# EAGLE schematic Cing_MainBoard (EAGLE 9.4.0)

## Sheet 1 of 7: Cing procesor socket schematic
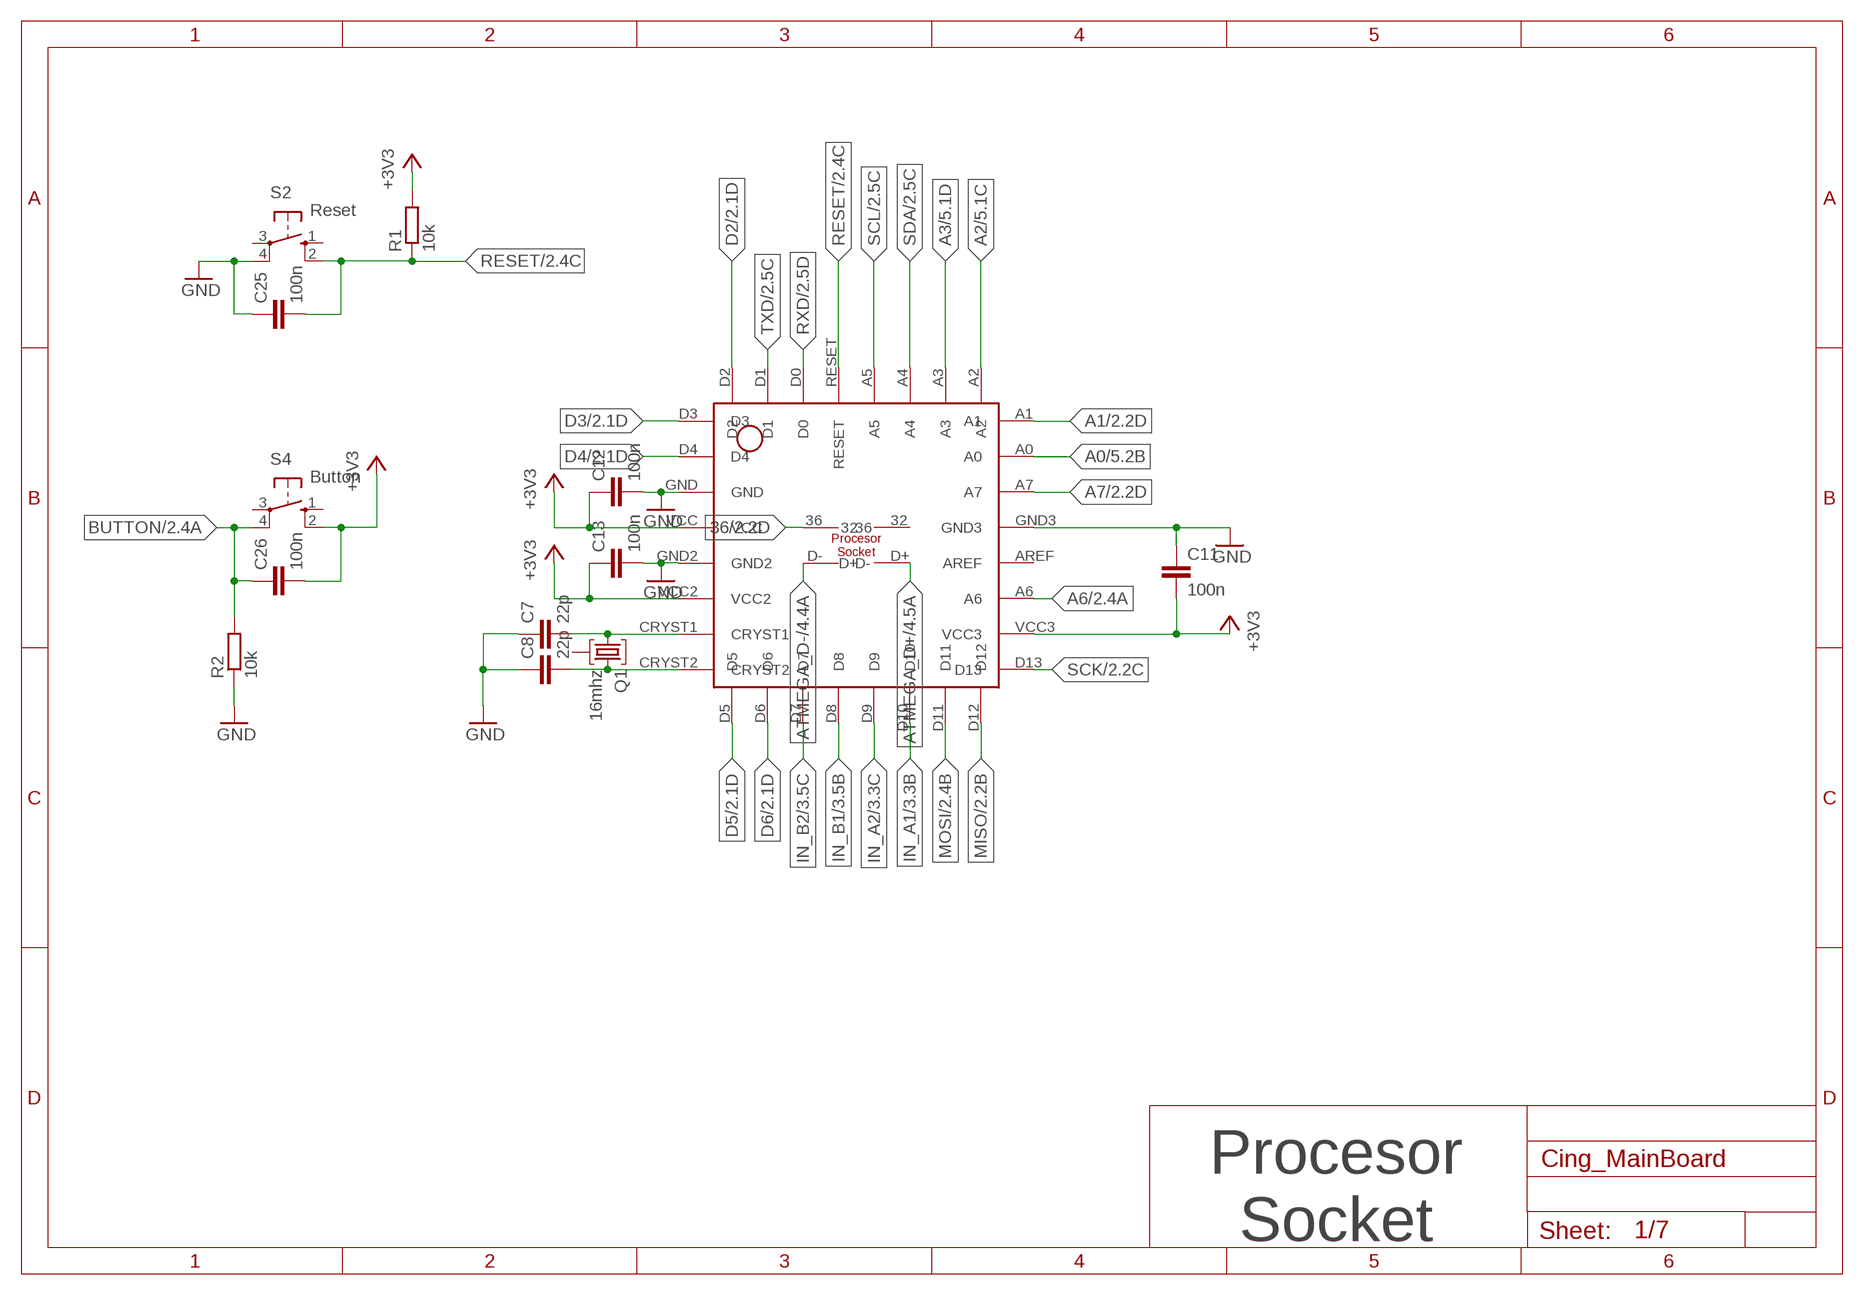
[diagram p0: schematic, sheet 1]

### Parts
C7  22p  C-EUC1206  [C1206]
C8  22p  C-EUC1206  [C1206]
C11  100n  C-EUC1206  [C1206]
C12  100n  C-EUC1206  [C1206]
C13  100n  C-EUC1206  [C1206]
C25  100n  C-EUC1206  [C1206]
C26  100n  C-EUC1206  [C1206]
Q1  16mhz  12M10AHC49HT  [HC49U]
R1  10k  R-EU_R1206  [R1206]
R2  10k  R-EU_R1206  [R1206]
S2  Reset  10-XX  [B3F-10XX]
S4  Button  10-XX  [B3F-10XX]
U$1  PROCESSOR-SOCKET_PCB  [PROCESSOR-SOCKET_PCB]

### Nets
36: U$1.36 ; also sheet 2
+3V3: C11.2 C12.1 C13.1 C26.2 R1.2 S4.2(S1) U$1.VCC U$1.VCC2 U$1.VCC3 ; also sheet 2,3,4,5,6
A0: U$1.A0 ; also sheet 5
A1: U$1.A1 ; also sheet 2,5
A2: U$1.A2 ; also sheet 5
A3: U$1.A3 ; also sheet 5
A6: U$1.A6 ; also sheet 2
A7: U$1.A7 ; also sheet 2,5
ATMEGA_D+: U$1.D+ ; also sheet 4
ATMEGA_D-: U$1.D- ; also sheet 4
BUTTON: C26.1 R2.2 S4.4(P1) ; also sheet 2
D2: U$1.D2 ; also sheet 2,6
D3: U$1.D3 ; also sheet 2
D4: U$1.D4 ; also sheet 2,5
D5: U$1.D5 ; also sheet 2,6
D6: U$1.D6 ; also sheet 2,3
GND: C7.1 C8.1 C11.1 C12.2 C13.2 C25.1 R2.1 S2.4(P1) U$1.GND U$1.GND2 U$1.GND3 ; also sheet 2,3,4,5,6
IN_A1: U$1.D10 ; also sheet 3
IN_A2: U$1.D9 ; also sheet 3
IN_B1: U$1.D8 ; also sheet 3
IN_B2: U$1.D7 ; also sheet 3
MISO: U$1.D12 ; also sheet 2,3
MOSI: U$1.D11 ; also sheet 2,3
N$7: C8.2 Q1.3 U$1.CRYST2
N$14: C7.2 Q1.1 U$1.CRYST1
RESET: C25.2 R1.1 S2.2(S1) U$1.RESET ; also sheet 2,5
RXD: U$1.D0 ; also sheet 2,5
SCK: U$1.D13 ; also sheet 2,5,6
SCL: U$1.A5 ; also sheet 2,4,5,6
SDA: U$1.A4 ; also sheet 2,4,5,6
TXD: U$1.D1 ; also sheet 2,5
Unconnected: Q1.2 S2.1(S) S2.3(P) S4.1(S) S4.3(P) U$1.32 U$1.AREF

### Notes on the sheet
- Procesor
  Socket

## Sheet 2 of 7: Connectors
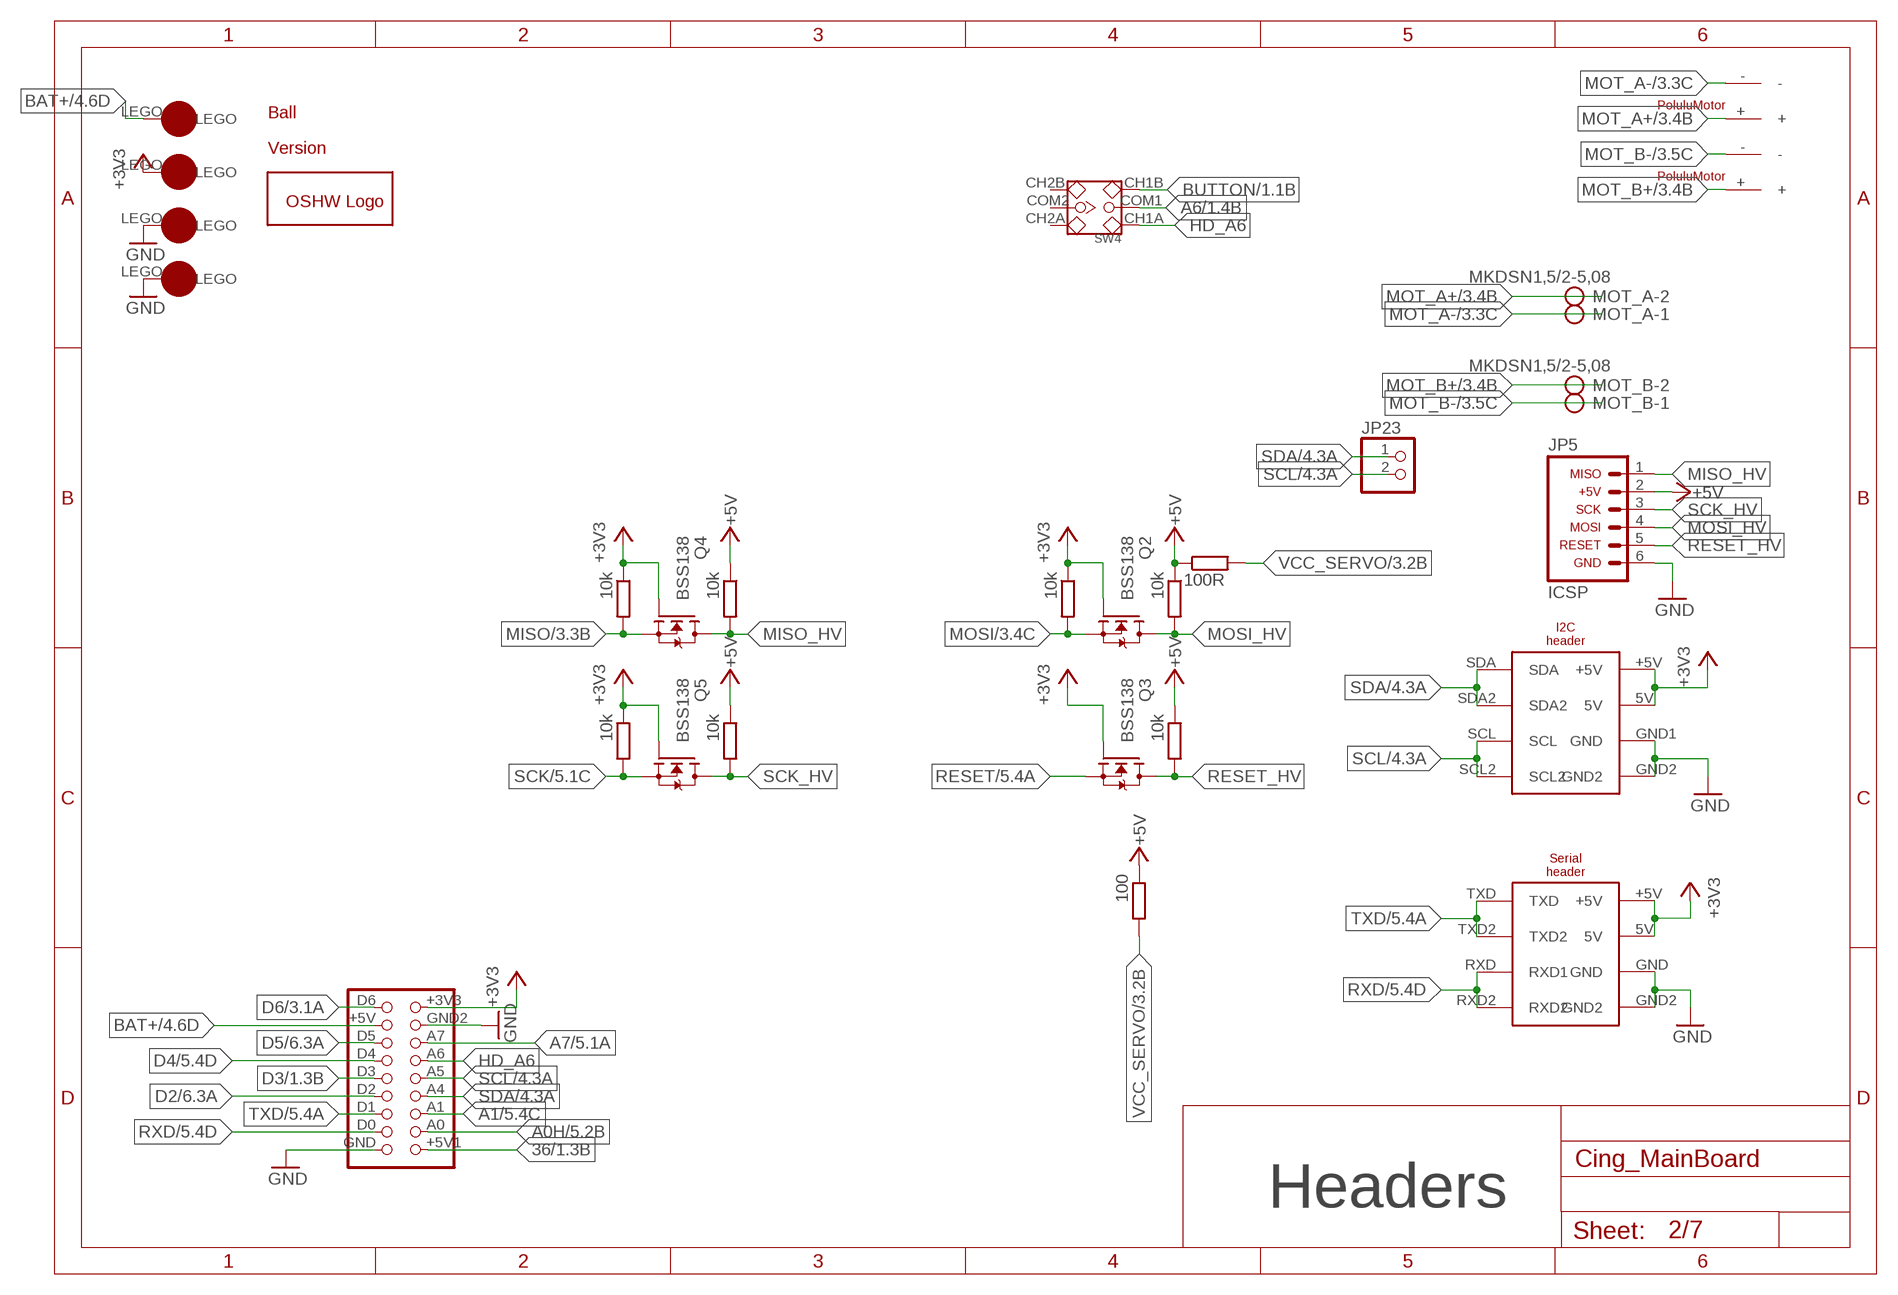
[diagram p1: schematic, sheet 2]

### Parts
JP5  ICSP  ICSP_HEADER  [ICSP_HEADER]
JP23  PINHD-1X2  [1X02]
MOT_A  MKDSN1,5/2-5,08  [MKDSN1,5/2-5,08]
MOT_B  MKDSN1,5/2-5,08  [MKDSN1,5/2-5,08]
Q2  BSS138  [SOT23]
Q3  BSS138  [SOT23]
Q4  BSS138  [SOT23]
Q5  BSS138  [SOT23]
R33  10k  R-EU_R1206  [R1206]
R34  10k  R-EU_R1206  [R1206]
R35  10k  R-EU_R1206  [R1206]
R36  100  R-EU_R1206  [R1206]
R37  10k  R-EU_R1206  [R1206]
R38  10k  R-EU_R1206  [R1206]
R39  10k  R-EU_R1206  [R1206]
R40  10k  R-EU_R1206  [R1206]
R44  100R  R-EU_R1206  [R1206]
SW4  USB_SWITCH  [USB_SWITCH]
U$2  Header 2  BIG_HEADER  [BIG_HEADER]
U$3  I2C_HEADER  [I2_HEADER]
U$4  SERIAL_HEADER  [SERIAL_HEADER]
U$9  POLULU_MOTOR  [POLULU_MOTOR]
U$16  BAT+  LEGO-1X1  [LEGO-1X1]
U$17  3.3V  LEGO-1X1  [LEGO-1X1]
U$18  GND  LEGO-1X1  [LEGO-1X1]
U$19  GND  LEGO-1X1  [LEGO-1X1]
U$20  BALL  [BALL]
U$22  OPENSOURCE  [OSHW_5MM]
U$24  POLULU_MOTOR  [POLULU_MOTOR]
VERSION  4.1  VERSION  [VERSION]

### Nets
36: U$2.+5V1 ; also sheet 1
+3V3: Q2.1(G) Q3.1(G) Q4.1(G) Q5.1(G) R34.1 R38.1 R40.1 U$2.+3V3 U$3.5V U$3.+5V U$4.5V U$4.+5V U$17.LEGO ; also sheet 1,3,4,5,6
+5V: JP5.2 R33.1 R35.1 R36.1 R37.1 R39.1 R44.1
A0H: U$2.A0 ; also sheet 5
A1: U$2.A1 ; also sheet 1,5
A6: SW4.COM1 ; also sheet 1
A7: U$2.A7 ; also sheet 1,5
BAT+: U$2.+5V U$16.LEGO ; also sheet 4
BUTTON: SW4.CH1B ; also sheet 1
D2: U$2.D2 ; also sheet 1,6
D3: U$2.D3 ; also sheet 1
D4: U$2.D4 ; also sheet 1,5
D5: U$2.D5 ; also sheet 1,6
D6: U$2.D6 ; also sheet 1,3
GND: JP5.6 U$2.GND U$2.GND2(GND1) U$3.GND1(GND) U$3.GND2 U$4.GND U$4.GND2 U$18.LEGO U$19.LEGO ; also sheet 1,3,4,5,6
HD_A6: SW4.CH1A U$2.A6
MISO: Q4.2(S) R38.2 ; also sheet 1,3
MISO_HV: JP5.1 Q4.3(D) R37.2
MOSI: Q2.2(S) R34.2 ; also sheet 1,3
MOSI_HV: JP5.4 Q2.3(D) R33.2
MOT_A+: MOT_A.2 U$24.+ ; also sheet 3
MOT_A-: MOT_A.1 U$24.- ; also sheet 3
MOT_B+: MOT_B.2 U$9.+ ; also sheet 3
MOT_B-: MOT_B.1 U$9.- ; also sheet 3
RESET: Q3.2(S) ; also sheet 1,5
RESET_HV: JP5.5 Q3.3(D) R35.2
RXD: U$2.D0 U$4.RXD2 U$4.RXD(RXD1) ; also sheet 1,5
SCK: Q5.2(S) R40.2 ; also sheet 1,5,6
SCK_HV: JP5.3 Q5.3(D) R39.2
SCL: JP23.2 U$2.A5 U$3.SCL U$3.SCL2 ; also sheet 1,4,5,6
SDA: JP23.1 U$2.A4 U$3.SDA U$3.SDA2 ; also sheet 1,4,5,6
TXD: U$2.D1 U$4.TXD U$4.TXD2 ; also sheet 1,5
VCC_SERVO: R36.2 R44.2 ; also sheet 3,4,6
Unconnected: SW4.CH2A SW4.CH2B SW4.COM2

### Notes on the sheet
- Headers

## Sheet 3 of 7: Motor driver schematic
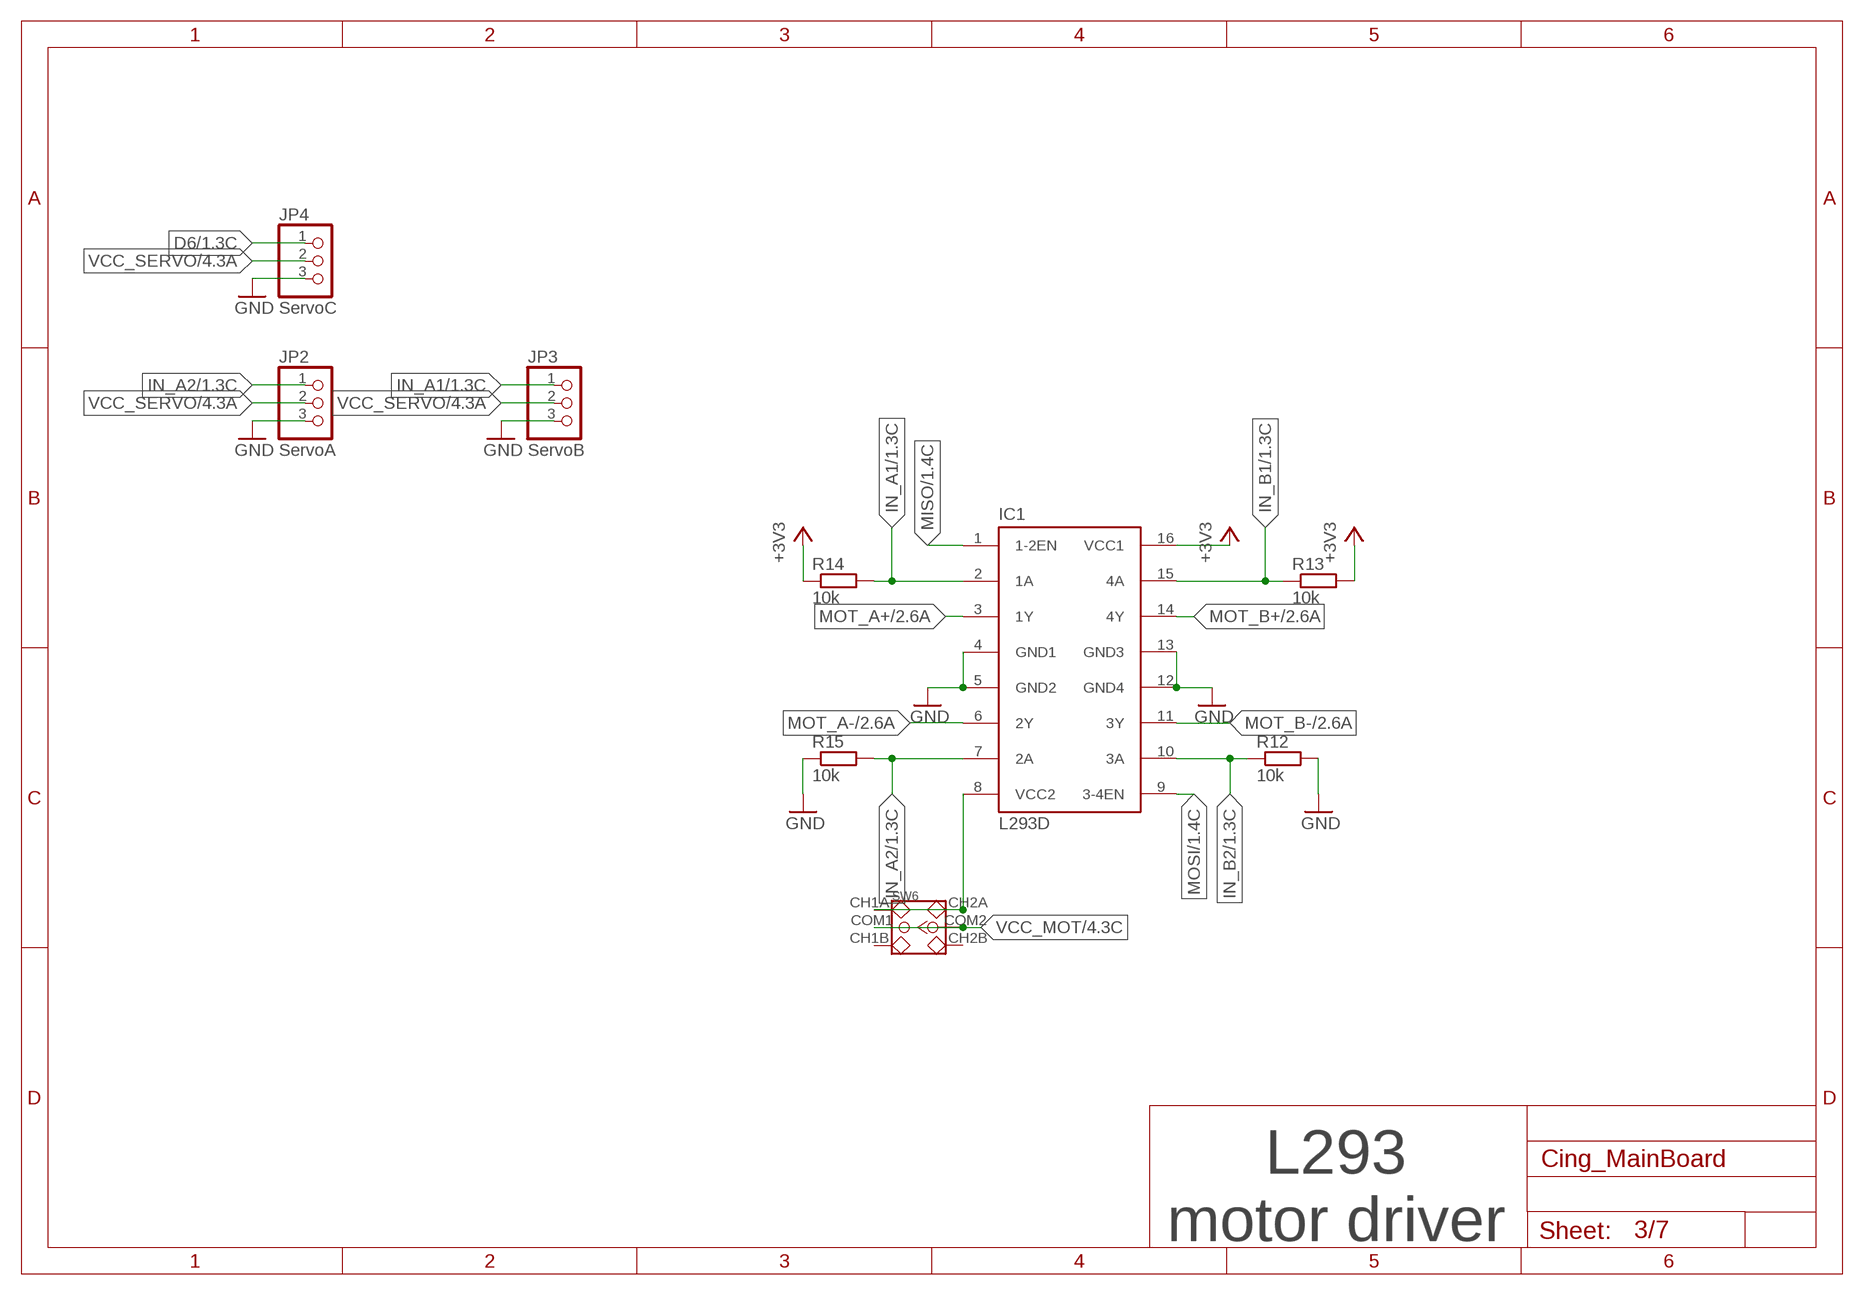
[diagram p2: schematic, sheet 3]

### Parts
IC1  L293D  L293D  [L293]
JP2  ServoA  PINHD-1X3  [1X03]
JP3  ServoB  PINHD-1X3  [1X03]
JP4  ServoC  PINHD-1X3  [1X03]
R12  10k  R-EU_R1206  [R1206]
R13  10k  R-EU_R1206  [R1206]
R14  10k  R-EU_R1206  [R1206]
R15  10k  R-EU_R1206  [R1206]
SW6  USB_SWITCH  [USB_SWITCH]

### Nets
+3V3: IC1.16(VCC1) R13.2 R14.1 ; also sheet 1,2,4,5,6
D6: JP4.1 ; also sheet 1,2
GND: IC1.4(GND1) IC1.5(GND2) IC1.12(GND4) IC1.13(GND3) JP2.3 JP3.3 JP4.3 R12.2 R15.1 ; also sheet 1,2,4,5,6
IN_A1: IC1.2(1A) JP3.1 R14.2 ; also sheet 1
IN_A2: IC1.7(2A) JP2.1 R15.2 ; also sheet 1
IN_B1: IC1.15(4A) R13.1 ; also sheet 1
IN_B2: IC1.10(3A) R12.1 ; also sheet 1
MISO: IC1.1(1-2EN) ; also sheet 1,2
MOSI: IC1.9(3-4EN) ; also sheet 1,2
MOT_A+: IC1.3(1Y) ; also sheet 2
MOT_A-: IC1.6(2Y) ; also sheet 2
MOT_B+: IC1.14(4Y) ; also sheet 2
MOT_B-: IC1.11(3Y) ; also sheet 2
N$4: IC1.8(VCC2) SW6.CH1A SW6.CH2A
VCC_MOT: SW6.COM1 SW6.COM2 ; also sheet 4
VCC_SERVO: JP2.2 JP3.2 JP4.2 ; also sheet 2,4,6
Unconnected: SW6.CH1B SW6.CH2B

### Notes on the sheet
- L293
  motor driver

## Sheet 4 of 7: Power circuits
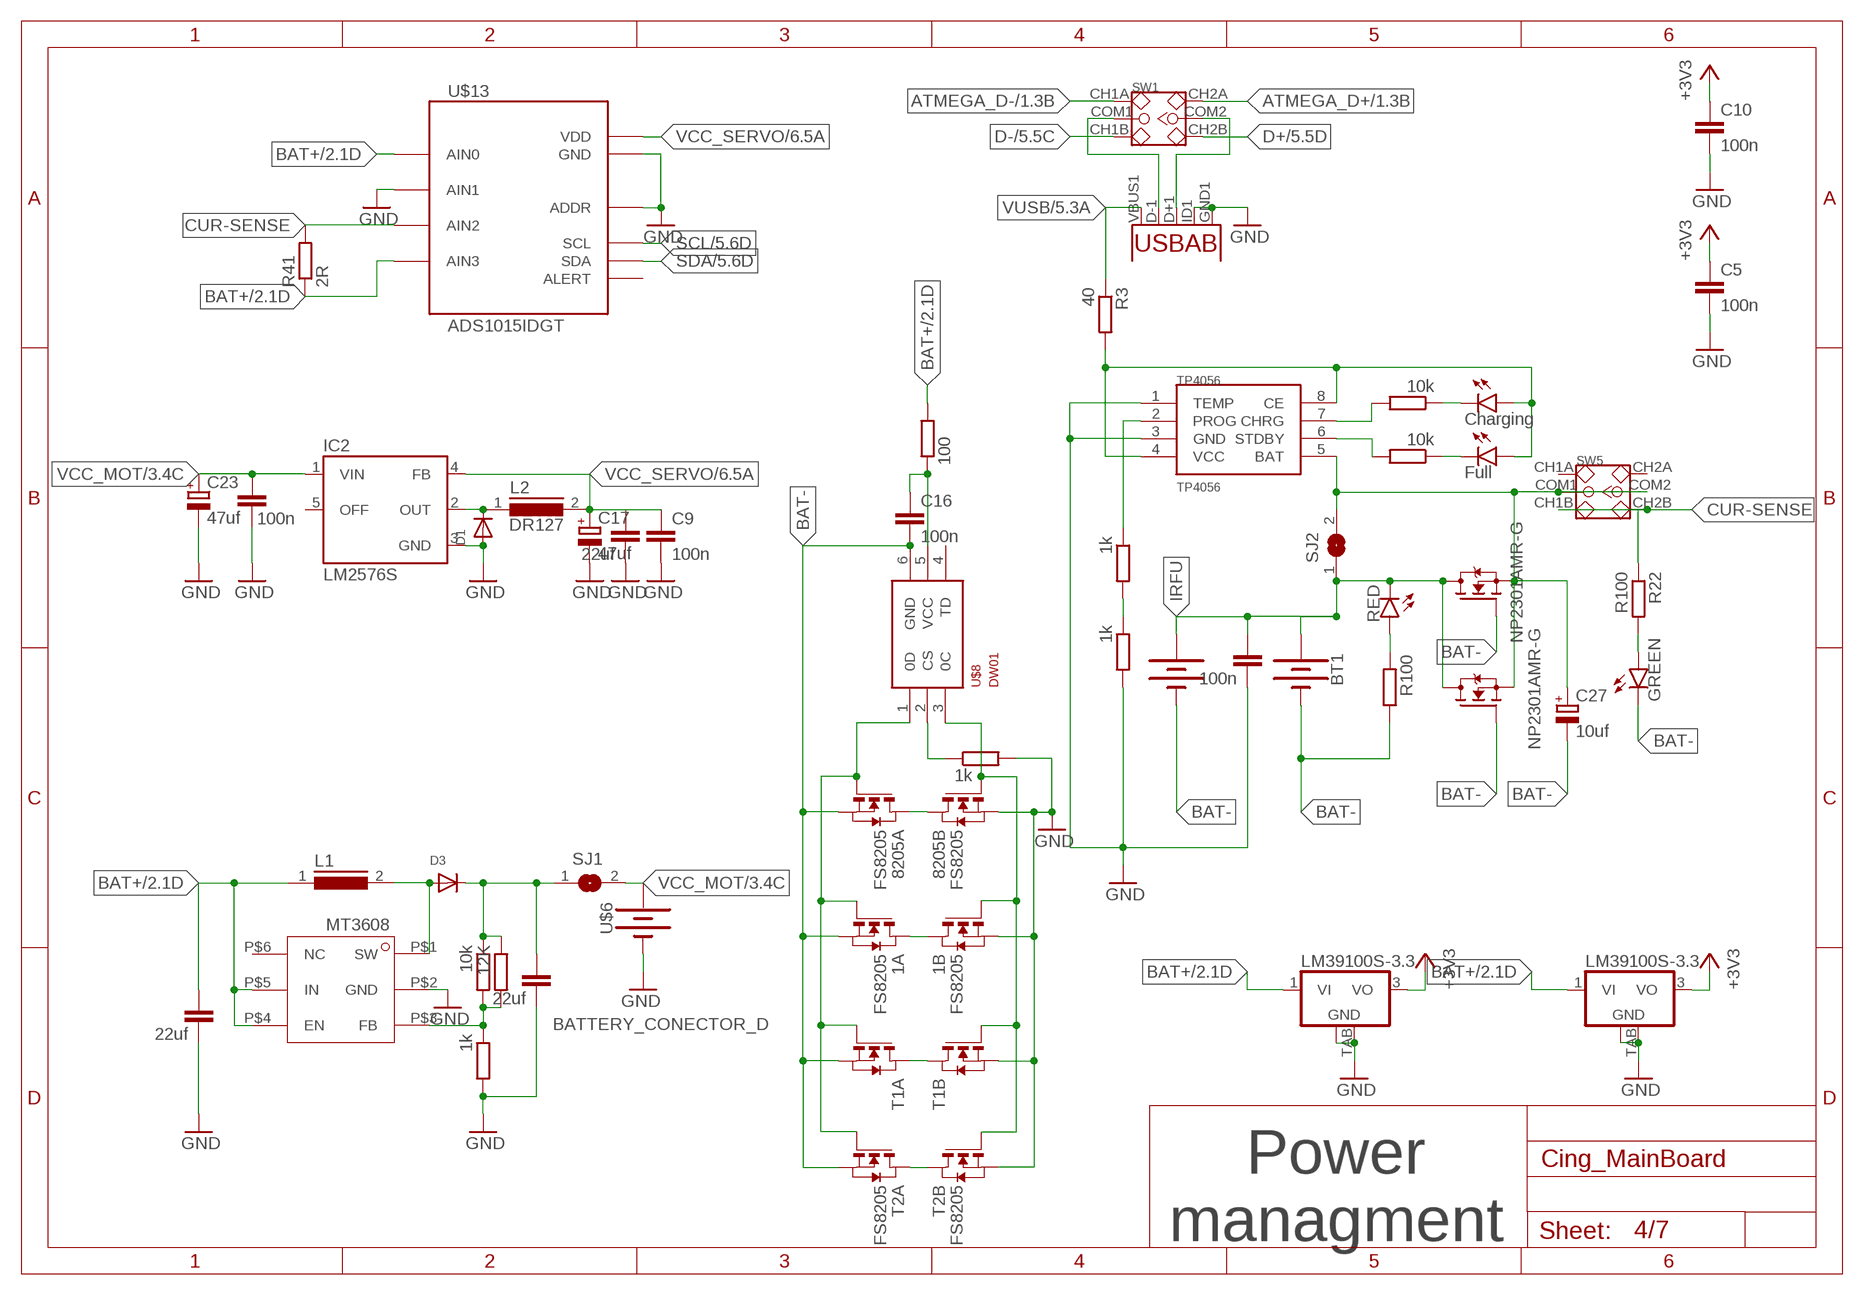
[diagram p3: schematic, sheet 4]

### Parts
1  FS8205  DMN3024LSD  [TSSOP-8]
8205  FS8205  DMN3024LSD  [TSSOP-8]
BT1  BATTERY-AA_KIT  [BATTERY-AA-KIT]
C1  100n  C-EUC1206  [C1206]
C4  22uf  C-EUC1206  [C1206]
C5  100n  C-EUC1206  [C1206]
C9  100n  C-EUC1206  [C1206]
C10  100n  C-EUC1206  [C1206]
C14  22uf  C-EUC1206  [C1206]
C15  22uf  C-EUC1206  [C1206]
C16  100n  C-EUC1206  [C1206]
C17  47uf  CPOL-EU153CLV-0505  [153CLV-0505]
C23  47uf  CPOL-EU153CLV-0505  [153CLV-0505]
C24  100n  C-EUC1206  [C1206]
C27  10uf  CPOL-EU153CLV-0505  [153CLV-0505]
D1  DIODESMA  [SMADIODE]
D3  DIODESMA  [SMADIODE]
IC2  LM2576S  [TO263-5]
L1  DR125  [DR125]
L2  DR127  [DR127]
LED1  Charging  LEDSMT1206  [1206]
ON  GREEN  LEDSMT1206  [1206]
Q6  NP2301AMR-G  [SOT23]
Q7  NP2301AMR-G  [SOT23]
R3  40  R-EU_R1206  [R1206]
R4  1k  R-EU_R1206  [R1206]
R5  10k  R-EU_R1206  [R1206]
R6  R100  R-EU_R1206  [R1206]
R8  1k  R-EU_R1206  [R1206]
R9  10k  R-EU_R1206  [R1206]
R11  10k  R-EU_R1206  [R1206]
R22  R100  R-EU_R1206  [R1206]
R41  2R  R-EU_R1206  [R1206]
R46  1k  R-EU_R1206  [R1206]
R47  1k  R-EU_R1206  [R1206]
R48  100  R-EU_R1206  [R1206]
R49  12K  R-EU_R1206  [R1206]
REV  RED  LEDSMT1206  [1206]
SJ1  SJW  [SJW]
SJ2  SJ  [SJ]
SW1  USB_SWITCH  [USB_SWITCH]
SW5  USB_SWITCH  [USB_SWITCH]
T1  FS8205  DMN3024LSD  [TSSOP-8]
T2  FS8205  DMN3024LSD  [TSSOP-8]
TP4056  TP4056  [TP4056]
U1  MICRO_USB""  [USB-MICRO-SMD]
U$5  MT3608SOT23-6  [SOT23-6]
U$6  BATTERY_CONECTOR_D  [BATTERY_CONECTOR_D]
U$7  BATTERY_CONECTOR_D  [BATTERY_CONECTOR_D]
U$8  DW01  [SOT23-6]
U$13  ADS1015IDGT  [MSOP10_0.5]
U$25  LM39100S-3.3  [LM39100S-3.3]
U$26  LM39100S-3.3  [LM39100S-3.3]
YELLOW  Full  LEDSMT1206  [1206]

### Nets
+3V3: C5.1 C10.1 U$25.3(VO) U$26.3(VO) ; also sheet 1,2,3,5,6
ATMEGA_D+: SW1.CH2A ; also sheet 1
ATMEGA_D-: SW1.CH1A ; also sheet 1
BAT+: C15.1 L1.1 R41.1 R48.2 U$5.P$4(EN) U$5.P$5(IN) U$13.4(AIN0) U$13.7(AIN3) U$25.1(VI) U$26.1(VI) ; also sheet 2
BAT-: 1.2(A:S) 1.3(A:S) 8205.2(A:S) 8205.3(A:S) BT1.GND@1(-) C16.2 C27.- ON.C Q6.1(G) Q7.1(G) R6.1 T1.2(A:S) T1.3(A:S) T2.2(A:S) T2.3(A:S) U$7.- U$8.6(GND)
CUR-SENSE: R22.1 R41.2 SW5.CH1B SW5.CH2B U$13.6(AIN2)
D+: SW1.CH2B ; also sheet 5
D-: SW1.CH1B ; also sheet 5
GND: 1.6(B:S) 1.7(B:S) 8205.6(B:S) 8205.7(B:S) C1.2 C4.2 C5.2 C9.2 C10.2 C14.2 C15.2 C17.- C23.- C24.2 D1.A IC2.3(GND) R8.2 R46.2 R47.2 T1.6(B:S) T1.7(B:S) T2.6(B:S) T2.7(B:S) TP4056.1(TEMP) TP4056.3(GND) U1.GND1(GND) U1.ID1(USBID) U$5.P$2(GND) U$6.- U$13.1(ADDR) U$13.3(GND) U$13.5(AIN1) U$25.2(GND) U$25.TAB(GND_2) U$26.2(GND) U$26.TAB(GND_2) ; also sheet 1,2,3,5,6
IRFU: BT1.PWR@1(+) C1.1 Q6.3(D) Q7.3(D) REV.C SJ2.1 U$7.+
N$3: 1.1(A:D) 1.8(B:D)
N$5: R6.2 REV.A
N$6: R4.2 R8.1
N$8: SW1.COM1 U1.D-1(D-)
N$9: LED1.C R5.1
N$13: SW1.COM2 U1.D+1(D+)
N$16: R11.1 YELLOW.C
N$18: R11.2 TP4056.6(STDBY)
N$19: R5.2 TP4056.7(CHRG)
N$21: D1.C IC2.2(OUT) L2.1
N$25: LED1.A R3.2 TP4056.4(VCC) TP4056.8(CE) YELLOW.A
N$26: C27.+ Q6.2(S) Q7.2(S) SJ2.2 SW5.COM1 SW5.COM2 TP4056.5(BAT)
N$27: R4.1 TP4056.2(PROG)
N$29: ON.A R22.2
N$35: R9.2 R46.1 R49.2 U$5.P$3(FB)
N$44: D3.A L1.2 U$5.P$1(SW)
N$46: C14.1 D3.C R9.1 R49.1 SJ1.1
N$47: 8205.1(A:D) 8205.8(B:D)
N$48: 1.4(A:G) 8205.4(A:G) T1.4(A:G) T2.4(A:G) U$8.1(0D)
N$49: 1.5(B:G) 8205.5(B:G) T1.5(B:G) T2.5(B:G) U$8.3(0C)
N$50: C16.1 R48.1 U$8.5(VCC)
N$54: R47.1 U$8.2(CS)
N$67: T1.1(A:D) T1.8(B:D)
N$68: T2.1(A:D) T2.8(B:D)
SCL: U$13.10(SCL) ; also sheet 1,2,5,6
SDA: U$13.9(SDA) ; also sheet 1,2,5,6
VCC_MOT: C23.+ C24.1 IC2.1(VIN) SJ1.2 U$6.+ ; also sheet 3
VCC_SERVO: C4.1 C9.1 C17.+ IC2.4(FB) L2.2 U$13.8(VDD) ; also sheet 2,3,6
VUSB: R3.1 U1.VBUS1(VBUS) ; also sheet 5
Unconnected: IC2.5(OFF) SW5.CH1A SW5.CH2A U$5.P$6(NC) U$8.4(TD) U$13.2(ALERT)

### Notes on the sheet
- Power
  managment

## Sheet 5 of 7: Board sensors and outputs
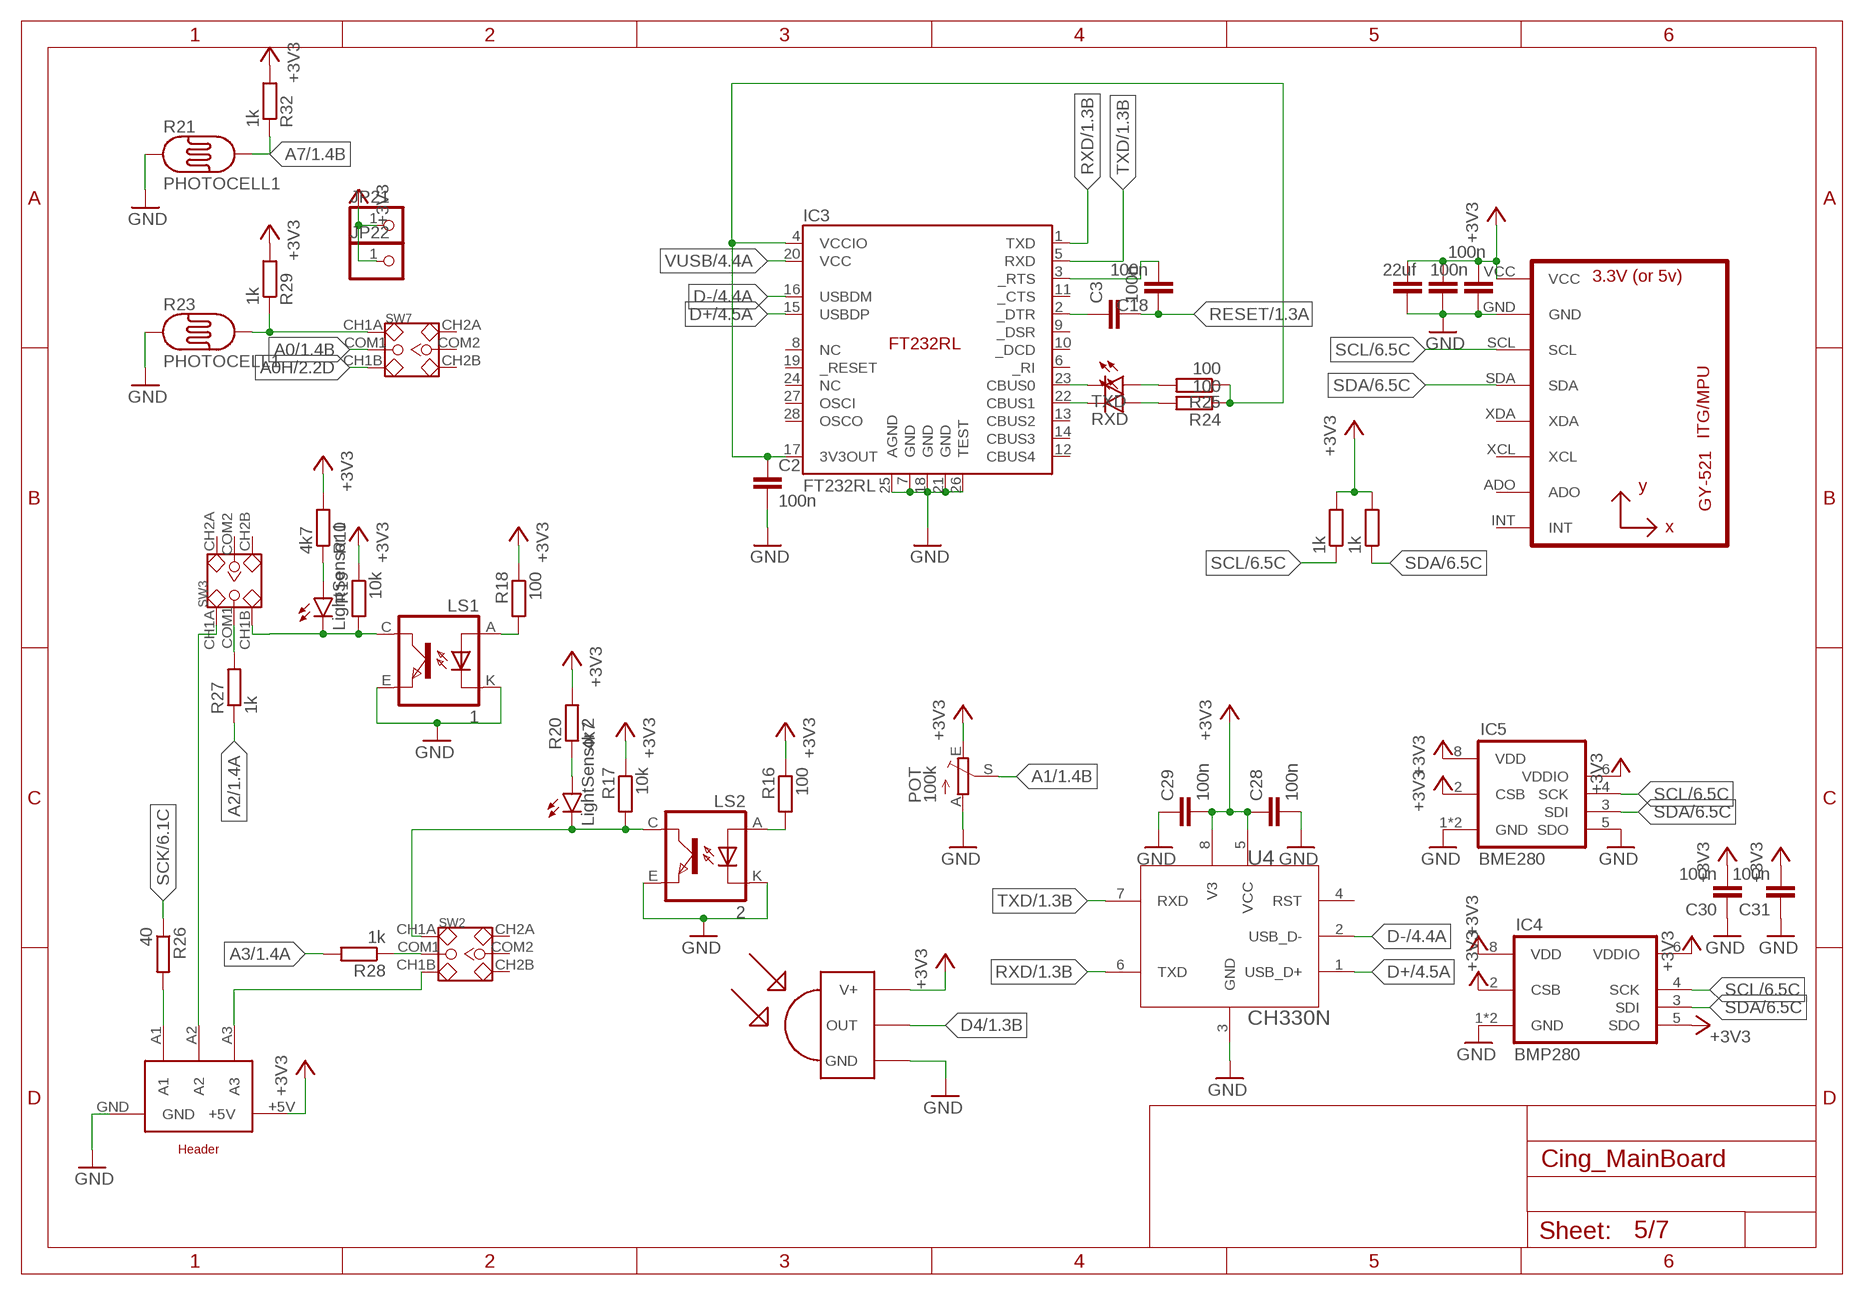
[diagram p4: schematic, sheet 5]

### Parts
C2  100n  C-EUC1206  [C1206]
C3  100n  C-EUC1206  [C1206]
C6  100n  C-EUC1206  [C1206]
C18  100n  C-EUC1206  [C1206]
C21  100n  C-EUC1206  [C1206]
C22  22uf  C-EUC1206  [C1206]
C28  100n  C-EUC1206  [C1206]
C29  100n  C-EUC1206  [C1206]
C30  100n  C-EUC1206  [C1206]
C31  100n  C-EUC1206  [C1206]
IC3  FT232RL  [FT232RL]
IC4  BMP280  [BMP280]
IC5  BME280  [BME280]
JP21  PINHD-1X1  [1X01]
JP22  PINHD-1X1  [1X01]
LED3  RXD  LEDSMT1206  [1206]
LS1  1  TCRT5000  [TCRT5000]
LS2  2  TCRT5000  [TCRT5000]
POT  100k  TRIM_EU-RJ9W  [RJ9W]
R10  4k7  R-EU_R1206  [R1206]
R16  100  R-EU_R1206  [R1206]
R17  10k  R-EU_R1206  [R1206]
R18  100  R-EU_R1206  [R1206]
R19  10k  R-EU_R1206  [R1206]
R20  4k7  R-EU_R1206  [R1206]
R21  PHOTOCELL1  [LDR_OFFBOARD]
R23  PHOTOCELL1  [LDR_OFFBOARD]
R24  100  R-EU_R1206  [R1206]
R25  100  R-EU_R1206  [R1206]
R26  40  R-EU_R1206  [R1206]
R27  1k  R-EU_R1206  [R1206]
R28  1k  R-EU_R1206  [R1206]
R29  1k  R-EU_R1206  [R1206]
R30  1k  R-EU_R1206  [R1206]
R31  1k  R-EU_R1206  [R1206]
R32  1k  R-EU_R1206  [R1206]
SW2  USB_SWITCH  [USB_SWITCH]
SW3  USB_SWITCH  [USB_SWITCH]
SW7  USB_SWITCH  [USB_SWITCH]
TSOP4838  TSOP4838  [TSOP18XX]
TXD  TXD  LEDSMT1206  [1206]
TXD1  LightSensor 1  LEDSMT1206  [1206]
TXD2  LightSensor 2  LEDSMT1206  [1206]
U3  MPU-6050MPU6050  [MPU-6050]
U4  CH330N  [SOIC-8N]
U$12  CONNECTOR_1X5  [CONNECTOR_1X5]

### Nets
+3V3: C6.2 C21.2 C22.1 C28.1 C29.2 C30.2 C31.2 IC4.2(CSB) IC4.5(SDO) IC4.6(VDDIO) IC4.8(VDD) IC5.2(CSB) IC5.6(VDDIO) IC5.8(VDD) JP21.1 JP22.1 POT.E R10.2 R16.1 R17.1 R18.1 R19.1 R20.2 R29.2 R30.2 R31.2 R32.2 TSOP4838.VCC(V+) U3.VCC U4.5(VCC) U4.8(V3) U$12.+5V ; also sheet 1,2,3,4,6
A0: SW7.COM1 ; also sheet 1
A0H: SW7.CH1B ; also sheet 2
A1: POT.S ; also sheet 1,2
A2: R27.1 ; also sheet 1
A3: R28.2 ; also sheet 1
A7: R21.2 R32.1 ; also sheet 1,2
D4: TSOP4838.OUT ; also sheet 1,2
D+: IC3.15(USBDP) U4.1(USB_D+) ; also sheet 4
D-: IC3.16(USBDM) U4.2(USB_D-) ; also sheet 4
GND: C2.2 C6.1 C21.1 C22.2 C28.2 C29.1 C30.1 C31.1 IC3.7(GND) IC3.18(GND) IC3.21(GND) IC3.25(AGND) IC3.26(TEST) IC4.1(GND) IC4.7(GND) IC5.1(GND) IC5.5(SDO) IC5.7(GND) LS1.E(EMITTER) LS1.K(CATHODE) LS2.E(EMITTER) LS2.K(CATHODE) POT.A R21.1 R23.1 TSOP4838.GND U3.GND U4.3(GND) U$12.GND ; also sheet 1,2,3,4,6
N$10: R28.1 SW2.COM1
N$15: R10.1 TXD1.A
N$17: R20.1 TXD2.A
N$20: LS2.A(ANODE) R16.2
N$22: LS1.A(ANODE) R18.2
N$24: LS1.C(COLLECTOR) R19.2 SW3.CH1B TXD1.C
N$31: SW3.CH1A U$12.A2
N$32: LED3.A R24.2
N$33: IC3.22(CBUS1) LED3.C
N$34: R25.2 TXD.A
N$36: C3.1 IC3.2(_DTR)
N$39: C2.1 IC3.4(VCCIO) IC3.17(3V3OUT) R24.1 R25.1
N$40: SW2.CH1B U$12.A3
N$42: R26.2 U$12.A1
N$43: R27.2 SW3.COM1
N$45: LS2.C(COLLECTOR) R17.2 SW2.CH1A TXD2.C
N$65: C18.2 IC3.3(_RTS)
N$66: R23.2 R29.1 SW7.CH1A
RESET: C3.2 C18.1 ; also sheet 1,2
RXD: IC3.1(TXD) U4.6(TXD) ; also sheet 1,2
SCK: R26.1 ; also sheet 1,2,6
SCL: IC4.4(SCK) IC5.4(SCK) R30.1 U3.SCL ; also sheet 1,2,4,6
SDA: IC4.3(SDI) IC5.3(SDI) R31.1 U3.SDA ; also sheet 1,2,4,6
T: IC3.23(CBUS0) TXD.C
TXD: IC3.5(RXD) U4.7(RXD) ; also sheet 1,2
VUSB: IC3.20(VCC) ; also sheet 4
Unconnected: IC3.6(_RI) IC3.8(NC) IC3.9(_DSR) IC3.10(_DCD) IC3.11(_CTS) IC3.12(CBUS4) IC3.13(CBUS2) IC3.14(CBUS3) IC3.19(_RESET) IC3.24(NC) IC3.27(OSCI) IC3.28(OSCO) SW2.CH2A SW2.CH2B SW2.COM2 SW3.CH2A SW3.CH2B SW3.COM2 SW7.CH2A SW7.CH2B SW7.COM2 U3.ADO U3.INT U3.XCL U3.XDA U4.4(RST)

## Sheet 6 of 7: Board sensors and outputs
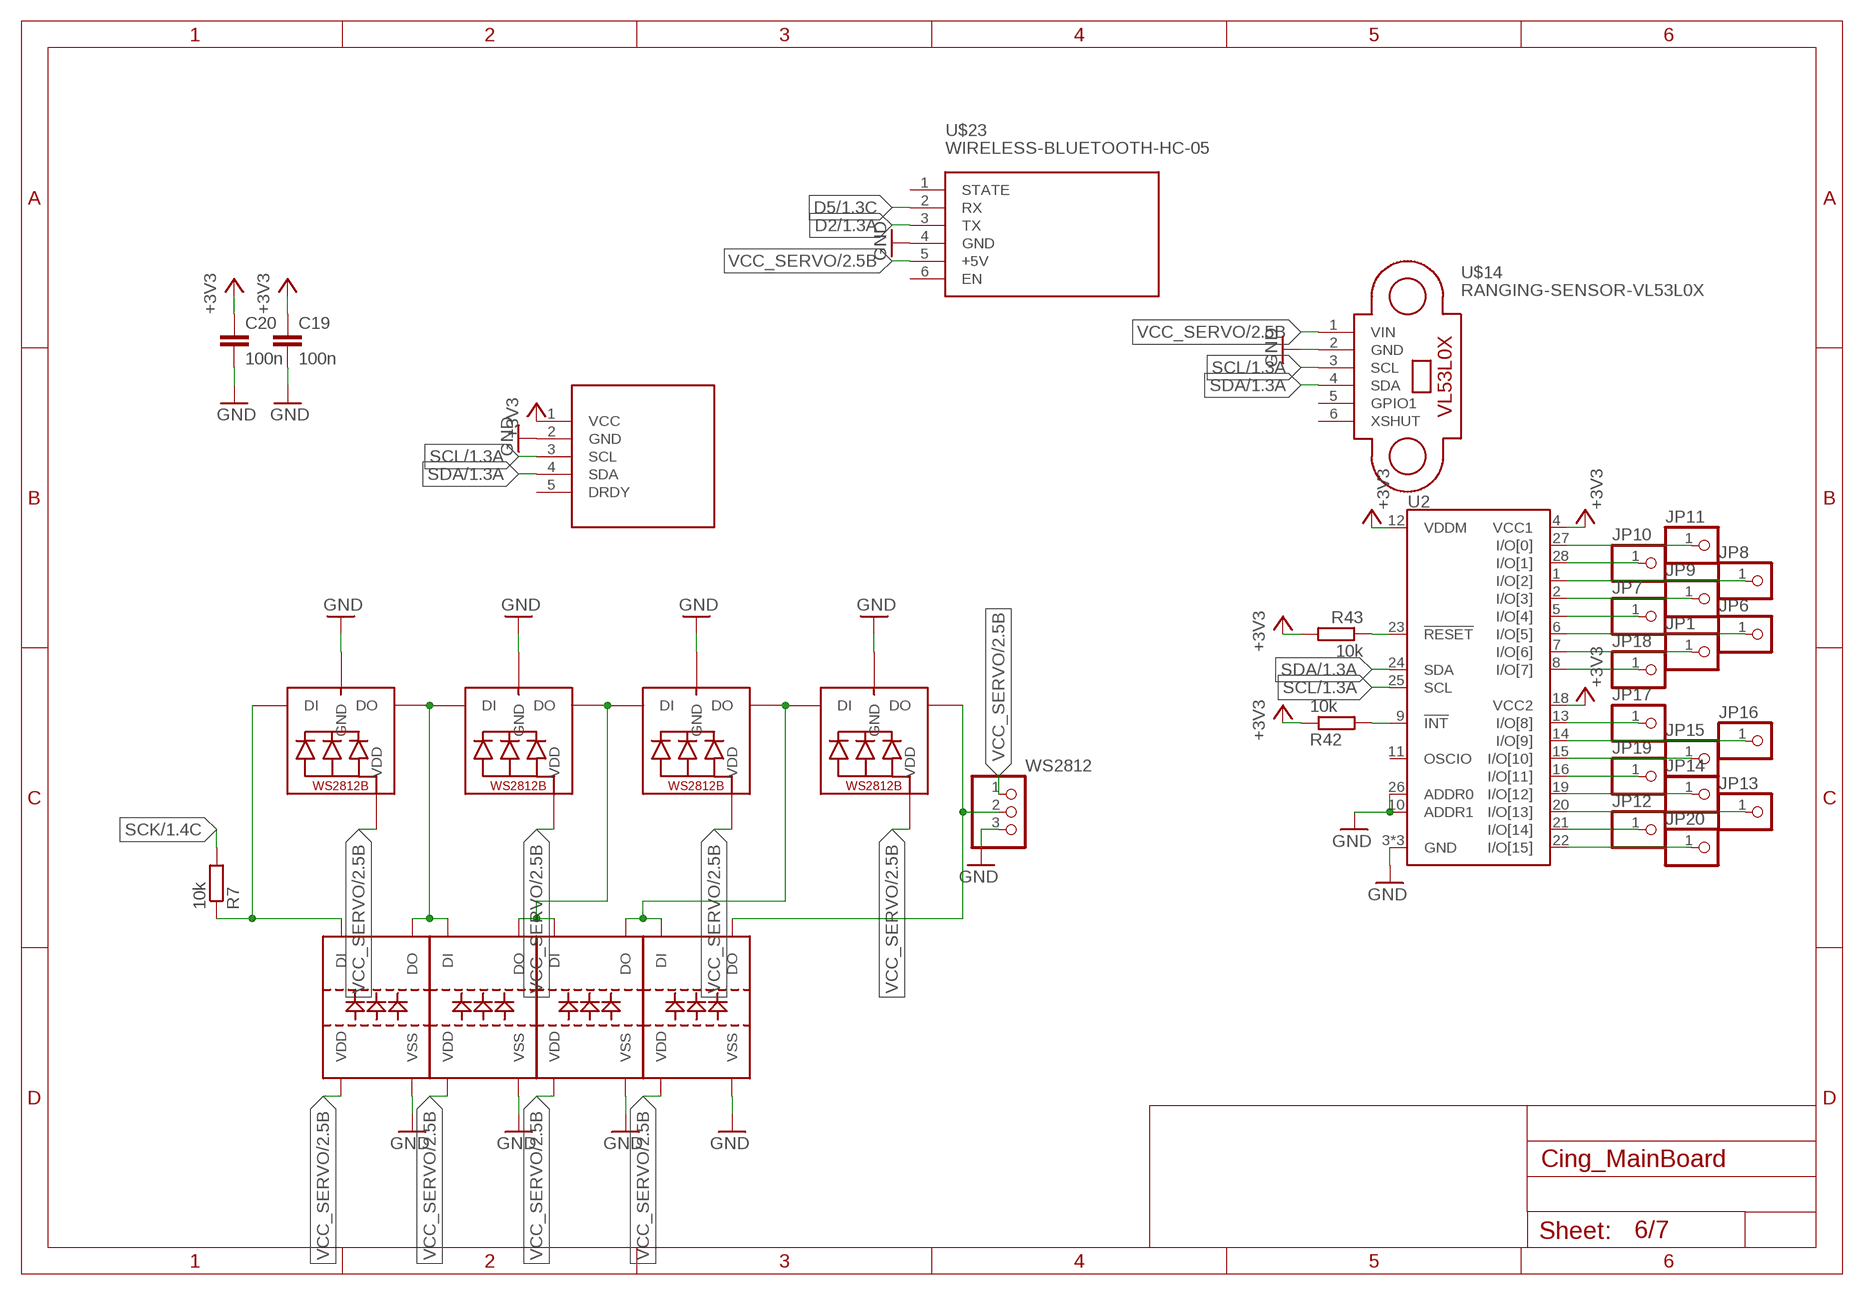
[diagram p5: schematic, sheet 6]

### Parts
C19  100n  C-EUC1206  [C1206]
C20  100n  C-EUC1206  [C1206]
JP1  PINHD-1X1  [1X01]
JP6  PINHD-1X1  [1X01]
JP7  PINHD-1X1  [1X01]
JP8  PINHD-1X1  [1X01]
JP9  PINHD-1X1  [1X01]
JP10  PINHD-1X1  [1X01]
JP11  PINHD-1X1  [1X01]
JP12  PINHD-1X1  [1X01]
JP13  PINHD-1X1  [1X01]
JP14  PINHD-1X1  [1X01]
JP15  PINHD-1X1  [1X01]
JP16  PINHD-1X1  [1X01]
JP17  PINHD-1X1  [1X01]
JP18  PINHD-1X1  [1X01]
JP19  PINHD-1X1  [1X01]
JP20  PINHD-1X1  [1X01]
LED4  WS2812B3535  [LED3535]
LED5  WS2812B  [WS2812B]
LED6  WS2812B  [WS2812B]
LED7  WS2812B  [WS2812B]
LED8  WS2812B  [WS2812B]
LED9  WS2812B3535  [LED3535]
LED10  WS2812B3535  [LED3535]
LED11  WS2812B3535  [LED3535]
R7  10k  R-EU_R1206  [R1206]
R42  10k  R-EU_R1206  [R1206]
R43  10k  R-EU_R1206  [R1206]
U2  SX1509  [QFN-28]
U$14  RANGING-SENSOR-VL53L0X  [RANGING-SENSOR-VL53L0X]
U$15  COMPASS-HMC5883L  [COMPASS-HMC5883L]
U$23  WIRELESS-BLUETOOTH-HC-05  [WIRELESS-BLUETOOTH-HC-05]
WS2812  PINHD-1X3  [1X03]

### Nets
+3V3: C19.1 C20.1 R42.1 R43.2 U2.4(VCC1) U2.12(VDDM) U2.18(VCC2) U$15.1(VCC) ; also sheet 1,2,3,4,5
D2: U$23.3(TX) ; also sheet 1,2
D5: U$23.2(RX) ; also sheet 1,2
GND: C19.2 C20.2 LED4.4(GND) LED5.3(VSS) LED6.3(VSS) LED7.3(VSS) LED8.3(VSS) LED9.4(GND) LED10.4(GND) LED11.4(GND) U2.3(GND) U2.10(ADDR1) U2.17(GND) U2.26(ADDR0) U2.29(GND) U$14.2(GND) U$15.2(GND) U$23.4(GND) WS2812.3 ; also sheet 1,2,3,4,5
N$1: LED5.2(DO) LED6.4(DI) LED9.1(DI) LED10.3(DO)
N$2: LED4.1(DI) LED6.2(DO) LED7.4(DI) LED9.3(DO)
N$11: LED4.3(DO) LED7.2(DO) LED8.4(DI) LED11.1(DI)
N$12: LED5.4(DI) LED10.1(DI) R7.1
N$23: R42.2 U2.9(!INT)
N$28: R43.1 U2.23(!RESET)
N$30: JP1.1 U2.7(I/O[6])
N$37: JP6.1 U2.6(I/O[5])
N$38: JP7.1 U2.5(I/O[4])
N$41: LED8.2(DO) LED11.3(DO) WS2812.2
N$51: JP8.1 U2.1(I/O[2])
N$52: JP9.1 U2.2(I/O[3])
N$53: JP10.1 U2.28(I/O[1])
N$55: JP11.1 U2.27(I/O[0])
N$56: JP12.1 U2.21(I/O[14])
N$57: JP13.1 U2.20(I/O[13])
N$58: JP14.1 U2.19(I/O[12])
N$59: JP15.1 U2.15(I/O[10])
N$60: JP16.1 U2.14(I/O[9])
N$61: JP17.1 U2.13(I/O[8])
N$62: JP18.1 U2.8(I/O[7])
N$63: JP19.1 U2.16(I/O[11])
N$64: JP20.1 U2.22(I/O[15])
SCK: R7.2 ; also sheet 1,2,5
SCL: U2.25(SCL) U$14.3(SCL) U$15.3(SCL) ; also sheet 1,2,4,5
SDA: U2.24(SDA) U$14.4(SDA) U$15.4(SDA) ; also sheet 1,2,4,5
VCC_SERVO: LED4.2(VDD) LED5.1(VDD) LED6.1(VDD) LED7.1(VDD) LED8.1(VDD) LED9.2(VDD) LED10.2(VDD) LED11.2(VDD) U$14.1(VIN) U$23.5(+5V) WS2812.1 ; also sheet 2,3,4
Unconnected: U2.11(OSCIO) U$14.5(GPIO1) U$14.6(XSHUT) U$15.5(DRDY) U$23.1(STATE) U$23.6(EN)

## Sheet 7 of 7: Board sensors and outputs
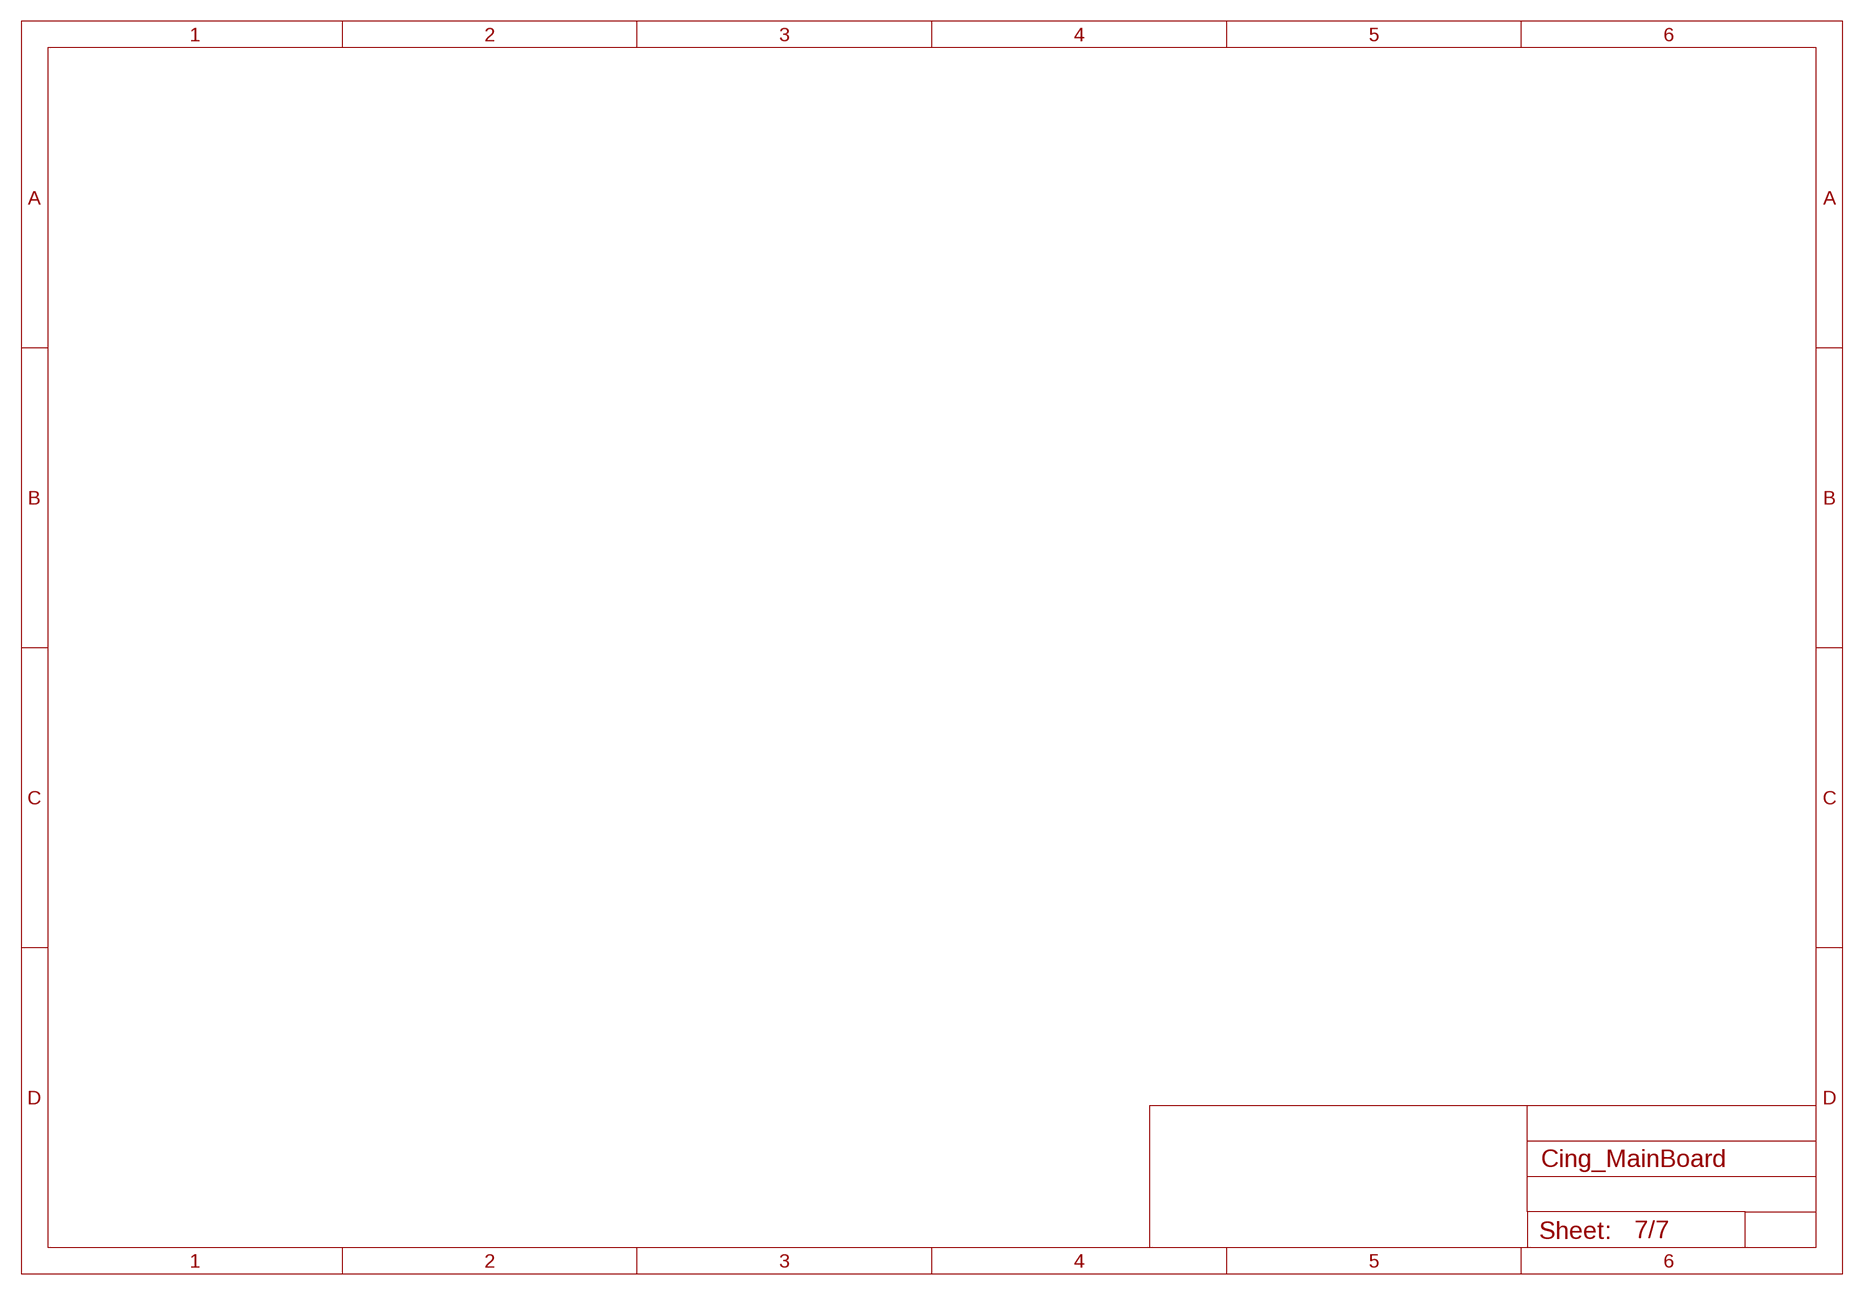
[diagram p6: schematic, sheet 7]

## Library data of the parts
1 8205 T1 T2 = FS8205A:DMN3024LSD: DUAL N-CHANNEL ENHANCEMENT MODE MOSFET data sheet <http://goo.gl/dRgboR> Dave.Calaway Eagle Library <https://goo.gl/Muy1Tr>
BT1 = Cing Library:BATTERY: Battery - Single Cell A variety of battery chemistries, sizes, and footprints. Device List: 20MM_PTH - Coin Cell Battery Holder - 20mm (PTH) <https://www.sparkfun.com/products/783> 6.8MM_PTH - Coin Cell Battery Holder - 6.8MM(SMD) <https://www.digikey.com/product-detail/en/seiko-instruments/MS621FE-FL11E/728-1057-ND/1889208?WT.srch=1&gclid=CNOQ5a6LzdQCFZS2wAodXCkE0g> 12MM_SMD - Coin Cell Battery Holder - 12mm (SMD) <https://www.sparkfun.com/products/10592> 12MM_PTH - Coin Cell Battery Holder - 12mm (PTH) <https://www.sparkfun.com/products/7948> 20MM_SMD - 20mm Coin Cell Battery Holder (SMD) (2 legs) Used on the Big Time Watch Kit <https://www.sparkfun.com/products/11734> 20MM_SMD_4LEGS - Coin Cell Battery Holder - 20mm (SMD) <https://www.sparkfun.com/products/11892> 20MM_SMD_4LEGS_OVERPASTE - Coin Cell Battery Holder - 20mm (SMD) <https://www.sparkfun.com/products/11892> (Over-paste on the legs) 24.5MM_PTH - Coin Cell Battery Holder - 24.5mm (PTH) <https://www.sparkfun.com/products/8863> 9V - 9V Battery Holder - PC Mount Used on the SparkFun SparkPunk Sound Kit <https://www.sparkfun.com/products/11177> and SparkFun SparkPunk Sequencer Kit <https://www.sparkfun.com/products/12707> 18650 - Battery Holder - 18650 (PTH) <https://www.sparkfun.com/products/13113> AA - Battery Holder - 1xAA (PTH) <https://www.sparkfun.com/products/7949> AAA - Battery Holder - 1xAAA (PTH) <https://www.sparkfun.com/products/12718> AA_KIT - Battery Holder - 1xAA (PTH) <https://www.sparkfun.com/products/7949> Special kit package - pads only have exposed copper on one side of the board. AAA_KIT - Battery Holder - 1xAAA (PTH) <https://www.sparkfun.com/products/12718> Special kit package - pads only have exposed copper on one side of the board.; PROD_ID: BATT-08316; SF_SKU: PRT-07949
C1-C16 C18-C22 C24-C26 C28-C31 = rcl:C-EU: CAPACITOR, European symbol; SPICEPREFIX: C
C17 C23 C27 = rcl:CPOL-EU: POLARIZED CAPACITOR, European symbol; SPICEPREFIX: C
D1 D3 = adafruit:DIODE: Diode SMADIODE - SMA Surface Mount Package 20V 1A Schottky Diode Digikey: 641-1014-6-ND DO-1N4148 - Through Hole Small Current Diode SOD-123 20V 1 A (.5mV Vf) Schottky Diode - Digikey: MBRX120TPMSCT-ND SOD-323 10V 570mA (.38mV Vf, 3ns) Schottky Diode - Digikey: ZLLS410CT-ND SOD-523 30V 30mA Schottky Diode (RB751S-40TE61) - Digikey: RB751S-40TE61CT-ND SOT23-R/W - SOT23 Package (R = Solder Paste/Reflow Ovens, W = Hand-Soldering) BAT54Film 40V 300mA - Digikey: 497-7162-1-ND
IC1 = Cing Library:L293D: PUSH-PULL 4 CHANNEL DRIVER; MPN: L293D; OC_FARNELL: 9589619; OC_NEWARK: 56P8249
IC2 = lm2576:LM2576: National Semiconductor <http://www.national.com> 3.0A "Simple Switcher"(c) 52kHz, Vout 1.23-37V (HV: 57V), Vin 40V (HV: 60V), 50µA standby current
IC3 = Cing Library:FT232RL
IC4 = bosch-bmp280:BMP280: The BMP280 is an absolute barometric pressure sensor especially designed for mobile applications. The sensor module is housed in an extremely compact 8-pin metal-lid LGA package with a footprint of only 2.0 × 2.5 mm2 and 0.95 mm package height. Its small dimensions and its low power consumption of 2.7 μA @1Hz allow the implementation in battery driven devices such as mobile phones, GPS modules or watches. The library has been designed by Richard Magdycz <https://www.facebook.com/groups/eaglecadsoftUK>
IC5 = bosch-bme280:BME280: DIGITAL HUMIDITY, PRESSURE AND TEMPERATURE SENSOR * Digital interface I²C (up to 3.4 MHz) and SPI (3 and 4 wire, up to 10 MHz)* Supply voltage VDD main supply voltage range: 1.71 V to 3.6 V*VDDIO interface voltage range: 1.2 V to 3.6 V Operating range -40…+85 °C, 0…100 % rel. humidity, 300…1100 hPa The library has been designed by Richard Magdycz <https://www.facebook.com/groups/eaglecadsoftUK>
JP1 JP6-JP22 = pinhead:PINHD-1X1: PIN HEADER
JP2-JP4 WS2812 = pinhead:PINHD-1X3: PIN HEADER
JP5 = Cing Library:ICSP_HEADER: Arduino ICSP I/O Header This is the ICSP I/O header on the Arduino Uno R3. This connector is labeled with the following pin assignments: MISO +5V SCK MOSI RESET GND NOTE: Be sure you install this connector with the correct orientation on your PCB layout. Pin 1 has a square pad to assist with orientation.
JP23 = pinhead:PINHD-1X2: PIN HEADER
L1 = inductors:DR125: High Power Density, High Efficiency, Shielded Inductors Source: coiltronics_dr_series.pdf; SPICEPREFIX: L
L2 = inductors:DR127: High Power Density, High Efficiency, Shielded Inductors Source: coiltronics_dr_series.pdf; SPICEPREFIX: L
LED1 LED3 ON REV TXD TXD1 TXD2 YELLOW = led:LED: LED OSRAM: - CHIPLED LG R971, LG N971, LY N971, LG Q971, LY Q971, LO R971, LY R971 LH N974, LH R974 LS Q976, LO Q976, LY Q976 LO Q996 - Hyper CHIPLED LW Q18S LB Q993, LB Q99A, LB R99A - SideLED LS A670, LO A670, LY A670, LG A670, LP A670 LB A673, LV A673, LT A673, LW A673 LH A674 LY A675 LS A676, LA A676, LO A676, LY A676, LW A676 LS A679, LY A679, LG A679 - Hyper Micro SIDELED® LS Y876, LA Y876, LO Y876, LY Y876 LT Y87S - SmartLED LW L88C, LW L88S LB L89C, LB L89S, LG L890 LS L89K, LO L89K, LY L89K LS L896, LA L896, LO L896, LY L896 - TOPLED LS T670, LO T670, LY T670, LG T670, LP T670 LSG T670, LSP T670, LSY T670, LOP T670, LYG T670 LG T671, LOG T671, LSG T671 LB T673, LV T673, LT T673, LW T673 LH T674 LS T676, LA T676, LO T676, LY T676, LB T676, LH T676, LSB T676, LW T676 LB T67C, LV T67C, LT T67C, LS T67K, LO T67K, LY T67K, LW E67C LS E67B, LA E67B, LO E67B, LY E67B, LB E67C, LV E67C, LT E67C LW T67C LS T679, LY T679, LG T679 LS T770, LO T770, LY T770, LG T770, LP T770 LB T773, LV T773, LT T773, LW T773 LH T774 LS E675, LA E675, LY E675, LS T675 LS T776, LA T776, LO T776, LY T776, LB T776 LHGB T686 LT T68C, LB T68C - Hyper Mini TOPLED® LB M676 - Mini TOPLED Santana® LG M470 LS M47K, LO M47K, LY M47K Source: http://www.osram.convergy.de LUXEON: - LUMILED® LXK2-PW12-R00, LXK2-PW12-S00, LXK2-PW14-U00, LXK2-PW14-V00 LXK2-PM12-R00, LXK2-PM12-S00, LXK2-PM14-U00 LXK2-PE12-Q00, LXK2-PE12-R00, LXK2-PE12-S00, LXK2-PE14-T00, LXK2-PE14-U00 LXK2-PB12-K00, LXK2-PB12-L00, LXK2-PB12-M00, LXK2-PB14-N00, LXK2-PB14-P00, LXK2-PB14-Q00 LXK2-PR12-L00, LXK2-PR12-M00, LXK2-PR14-Q00, LXK2-PR14-R00 LXK2-PD12-Q00, LXK2-PD12-R00, LXK2-PD12-S00 LXK2-PH12-R00, LXK2-PH12-S00 LXK2-PL12-P00, LXK2-PL12-Q00, LXK2-PL12-R00 Source: www.luxeon.com KINGBRIGHT: KA-3528ASYC Source: www.kingbright.com
LED4 LED9-LED11 = adafruit:WS2812B
LED5-LED8 = Cing Library:WS2812B
LS1 LS2 = Cing Library:TCRT5000
MOT_A MOT_B = con-phoenix-508:MKDSN1,5/2-5,08: MKDSN 1,5/ 2-5,08 Printklemme Nennstrom: 13,5 A Nennspannung: 250 V Rastermaß: 5,08 mm Polzahl: 2 Anschlussart: Schraubanschluss Montage: Löten Anschlussrichtung Leiter/Platine: 0 ° Artikelnummer: 1729128 Source: http://eshop.phoenixcontact.com .. 1729128.pdf
POT = pot:TRIM_EU-: POTENTIOMETER
Q1 = crystal:12M10AHC49HT: Monolithic Crystal Filters Source: www.vanlong.com; OC_FARNELL: unknown; OC_NEWARK: unknown
Q2-Q5 = Cing Library:BSS138: BSS138 N-Channel Logic Level Enhancement Mode Field Effect Transistor Source: http://www.fairchildsemi.com/datasheets/BS/BSS138.pdf; MF: Fairchild; MPN: BSS138; OC_FARNELL: 9845330; OC_NEWARK: 67R2009
Q6 Q7 = Cing Library:NP2301AMR-G: BSS138 N-Channel Logic Level Enhancement Mode Field Effect Transistor Source: http://www.fairchildsemi.com/datasheets/BS/BSS138.pdf; MF: Fairchild; MPN: BSS138; OC_FARNELL: 9845330; OC_NEWARK: 67R2009
R1-R20 R22 R24-R44 R46-R49 = rcl:R-EU_: RESISTOR, European symbol; SPICEPREFIX: R
R21 R23 = LDR:PHOTOCELL: Photo Resitor
S2 S4 = switch-omron:10-XX: OMRON SWITCH; MPN: B3F-1000; OC_FARNELL: 176432; OC_NEWARK: 36M3542
SJ1 SJ2 = jumper:SJ: SMD solder JUMPER
SW1-SW7 = Cing Library:USB_SWITCH: 311030005
TP4056 = Cing Library:TP4056
TSOP4838 = Cing Library:TSOP4838: IR Receiver and Demodulator
U1 = Cing Library:MICRO_USB: This is a USB AB connector that is compatible with USB OTG. i.e. this connector can serve as a host or device
U2 = Cing Library:SX1509: Semtech SX1509 The SX1509 is a complete ultra low voltage 1.2V to 3.6V General Purpose parallel Input/Output (GPIO) expanders ideal for low power handheld battery powered equipment. This version comes in a 16-channel configuration and allows easy serial expansion of I/O through a standard 400kHz I2C interface. GPIO devices can provide additional control and monitoring when the microcontroller or chipset has insufficient I/O ports, or in systems where serial communication and control from a remote location is advantageous.
U3 = Cing Library:MPU-6050
U4 = Cing Library:CH330N: IC OSC SINGLE TIMER 8-SOP Manufacturer's datasheet <https://www.onsemi.com/pub/Collateral/LM555-D.pdf>; CREATED_BY: PCBLayout.com; DIGI-KEY_PART: LM555CMFS-ND; MANUFACTURER: ON Semiconductor; MPN: LM555CM; PACKAGE: SOIC-8
U$1 = Cing Library:PROCESSOR-SOCKET_PCB
U$2 = Cing Library:BIG_HEADER
U$3 = Cing Library:I2C_HEADER
U$4 = Cing Library:SERIAL_HEADER
U$5 = MT3608:MT3608: MT3608 High Efficiency 1.2MHz 2A Step Up Converter BY: Rangana Tennakoon
U$6 U$7 = Cing Library:BATTERY_CONECTOR_D
U$8 = DW01:DW01: The DW01-P battery protection IC is designed to protect lithium-ion/polymer battery from damage or degrading the lifetime due to overcharge, overdischarge, and/or overcurrent for one-cell lithium-ion/polymer battery powered systems, such as cellular phones. Data sheet <http://goo.gl/4y108d> Dave.Calaway Eagle Library <https://goo.gl/Muy1Tr>
U$9 U$24 = Cing Library:POLULU_MOTOR
U$12 = Cing Library:CONNECTOR_1X5
U$13 = bt_adc:ADS1015: Ti ADS1015 12-bit ADC Ultra-Small, Low-Power, 12-Bit Analog-to-Digital Converter with Internal Reference The ADS1013, ADS1014, and ADS1015 are precision analog-to-digital converters (ADCs) with 12 bits of resolution offered in an ultra-small, leadless QFN-10 package or an MSOP-10 package. \ Source: http://focus.ti.com/docs/prod/folders/print/ads1015.html
U$14 = diy-modules:RANGING-SENSOR-VL53L0X: Laser Ranging Sensor based on VL53L0X device More information about VL53L0X device can be found here: http://www.st.com/en/imaging-and-photonics-solutions/vl53l0x.html Arduino Library for VL53L0X is available here: https://github.com/pololu/vl53l0x-arduino Click here to find device on ebay.com <http://www.ebay.com/sch/GY+VL53L0X+module> Note: There are many variants. Search for the proper version.
U$15 = diy-modules:COMPASS-HMC5883L: 3-Axis Digital Compass Module based on HMC5883L chip More details available here: http://www.electrodragon.com/w/HMC Click here to find device on ebay.com <http://www.ebay.com/sch/gy+271+hmc5883+ module>
U$16-U$19 = Cing Library:LEGO-1X1
U$20 = Cing Library:BALL
U$22 = Cing Library:OPENSOURCE
U$23 = Cing Library:WIRELESS-BLUETOOTH-HC-05: Bluetooth Transceiver Module based on HC-05 board Tutorial is available here: https://arduino-info.wikispaces.com/BlueTooth-HC05-HC06-Modules-How-To Click here to find device on ebay.com <http://www.ebay.com/sch/hc-05+module+rs232>
U$25 U$26 = Cing Library:LM39100S-3.3
VERSION = Cing Library:VERSION